# Altium schematic sheet adc.SchDoc: ADC
size A; Organization: UCLA HEP; DocumentNumber: 13; Revision: 2.0; SheetNumber: 13; SheetTotal: 14
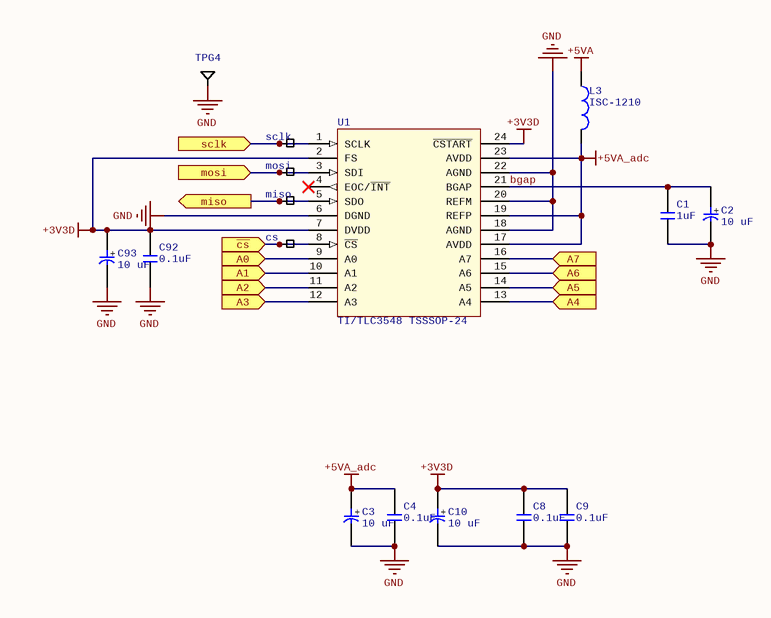
[diagram p0: adc.SchDoc]

## Parts
C1  1uF  [C0603]
C2  10 uF  [KEMET 1206]
C3  10 uF  [KEMET 1206]
C4  0.1uF  [C0603]
C8  0.1uF  [C0603]
C9  0.1uF  [C0603]
C10  10 uF  [KEMET 1206]
C92  0.1uF  [C0603]
C93  10 uF  [KEMET 1206]
cs  TP_SMALL  [TP_SMALL]  (value not drawn)
L3  ISC-1210  [ISC-1210]
miso  TP_SMALL  [TP_SMALL]  (value not drawn)
mosi  TP_SMALL  [TP_SMALL]  (value not drawn)
sclk  TP_SMALL  [TP_SMALL]  (value not drawn)
TPG4  TPG  [TPG]  (value not drawn)
U1  TI/TLC3548 TSSSOP-24  [TSSOP-24]

## Ports
A0 (in), A1 (in), A2 (in), A3 (in), A4 (in), A5 (in), A6 (in), A7 (in), miso (out), mosi (in), sclk (in), ~{cs} (in)

## Nets
+3V3D: C8.2 C9.2 C10.1(+) C92.2 C93.1(+) U1.2(FS) U1.7(DVDD) U1.24(~{CSTART})
+5VA: L3.2
+5VA_adc: C3.1(+) C4.2 L3.1 U1.17(AVDD) U1.19(REFP) U1.23(AVDD)
GND: C1.2 C2.2(-) C3.2(-) C4.1 C8.1 C9.1 C10.2(-) C92.1 C93.2(-) TPG4.1 U1.6(DGND) U1.18(AGND) U1.20(REFM) U1.22(AGND)
A0: U1.9(A0) ; port A0
A1: U1.10(A1) ; port A1
A2: U1.11(A2) ; port A2
A3: U1.12(A3) ; port A3
A4: U1.13(A4) ; port A4
A5: U1.14(A5) ; port A5
A6: U1.15(A6) ; port A6
A7: U1.16(A7) ; port A7
bgap: C1.1 C2.1(+) U1.21(BGAP)
~{cs}: cs.1 U1.8(~{CS}) ; port ~{cs}
miso: miso.1 U1.5(SDO) ; port miso
mosi: mosi.1 U1.3(SDI) ; port mosi
sclk: sclk.1 U1.1(SCLK) ; port sclk

Not connected (* = marked no-connect by the designer): U1 4(EOC/~{INT})*

## Notes on the sheet
- Size:
- A
- Revision:
- Date:
- Sheet
- of

## Library data of the parts
C1 = Murata/GRM188R61E105KA12D: CAP2, CER, 1.0uF, 10%, 25V, 0603; Manufacturer: Murata Electronics North America; Capacitance: 1µF; Temperature Coefficient: X5R; Supplier 1: Digi-Key; Supplier Part Number 1: 490-3897-1-ND; Manufacturer Part Number: GRM188R61E105KA12D; RoHS: RoHS Compliant; Category: Capacitors; Stock 1: 1899119; Pricing 1: 1=0.1, 10=0.036, 50=0.0196, 100=0.0165, 250=0.01352, 500=0.01156, 1000=0.009 (USD); Packaging: Cut Tape (CT); Tolerance: ±10%; Voltage - Rated: 25V; Mounting Type: Surface Mount, MLCC; Operating Temperature: -55°C ~ 85°C; Applications: General Purpose; Ratings: -; Package / Case: 0603 (1608 Metric); Size / Dimension: 0.063" L x 0.031" W (1.60mm x 0.80mm); Height - Seated (Max): -; Thickness (Max): 0.035" (0.90mm); Lead Spacing: -; Features: -; Lead Style: -; ComponentLink1URL: http://www.murata.com/~/media/webrenewal/support/library/catalog/products/capacitor/mlcc/c02e.pdf; ComponentLink1Description: http://www.murata.com/~/media/webrenewal/support/library/catalog/products/capacitor/mlcc/c02e.pdf
C2 C3 C10 C93 = Kemet/T491A106K010AT: CAP2, TANT,  10uF, 10%, 10V, 1206; Manufacturer: Kemet; Manufacturer Size Code: A; Capacitance: 10µF; ESR (Equivalent Series Resistance): 3.8 Ohm; Type: Molded; Lifetime @ Temp.: 2000 Hrs @ 85°C; Supplier 1: Newark; Manufacturer Part Number: T491A106K010AT; RoHS: RoHS Compliant; Category: Capacitors; Packaging: Cut Tape (CT); Tolerance: ±10%; Voltage - Rated: 10V; Mounting Type: Surface Mount; Operating Temperature: -55°C ~ 125°C; Package / Case: 1206 (3216 Metric); Size / Dimension: 0.126" L x 0.063" W (3.20mm x 1.60mm); Height - Seated (Max): 0.071" (1.80mm); Lead Spacing: -; Features: General Purpose; ComponentLink1URL: http://www.kemet.com/Lists/ProductCatalog/Attachments/254/KEM_T2005_T491.pdf; ComponentLink1Description: http://www.kemet.com/Lists/ProductCatalog/Attachments/254/KEM_T2005_T491.pdf; Supplier Part Number 1: 57K1635; Supplier 2: Digi-Key; Stock 2: 145394; Pricing 2: 1=0.38, 10=0.337, 50=0.2044, 100=0.1684, 250=0.13468, 500=0.12266, 1000=0.11063 (USD); Supplier Part Number 2: 399-3684-6-ND; Supplier 3: Digi-Key; Supplier Part Number 3: 399-3684-1-ND
C4 C8 C9 C92 = CAP/06035C104KAT2A: CAP2, CER, 0.1uF, 10%, 50V, 0603, X7R; Manufacturer: AVX Corporation; Capacitance: 0.10µF; Supplier 1: Digi-Key; Manufacturer Part Number: 06035C104KAT2A; RoHS: RoHS Compliant; Category: Capacitors; Stock 1: 4412408; Pricing 1: 1=0.1, 10=0.036, 25=0.0264, 50=0.0198, 100=0.0162, 250=0.01352, 500=0.01156, 1000=0.00908 (USD); Packaging: Cut Tape (CT); Tolerance: ±10%; Voltage - Rated: 50V; Temperature Coefficient: X7R; Mounting Type: Surface Mount, MLCC; Operating Temperature: -55°C ~ 125°C; Applications: General Purpose; Ratings: -; Package / Case: 0603 (1608 Metric); Size / Dimension: 0.063" L x 0.032" W (1.60mm x 0.81mm); Height - Seated (Max): -; Thickness (Max): 0.035" (0.90mm); Lead Spacing: -; Features: -; Lead Style: -; ComponentLink1URL: http://datasheets.avx.com/X7RDielectric.pdf; ComponentLink1Description: http://datasheets.avx.com/X7RDielectric.pdf; Supplier 2: Newark; Supplier Part Number 1: 478-5052-1-ND; Supplier Part Number 2: 54K2412
cs miso mosi sclk = TP_SMALL: Test Point, Generic, 50MIL
L3 = ISC-1210: IND, 86uF, 90mA; Supplier 1: Digi-Key; Supplier Part Number 1: 541-1604-1-ND
TPG4 = TPG: Test Point, GND, Through Hole
U1 = TI/TLC3548 TSSSOP-24: ADC, 14-Bit,; Manufacturer: Texas Instruments; Manufacturer Part Number: TLC3548CPW; Number of Bits: 14; Sampling Rate (Per Second): 200k; Number of Inputs: 8; Input Type: Pseudo-Differential, Single Ended; Data Interface: SPI, DSP; Configuration: MUX-S/H-ADC; Ratio - S/H:ADC: 1:1; Number of A/D Converters: 1; Architecture: SAR; Reference Type: Internal; Voltage - Supply, Analog: 5V; Voltage - Supply, Digital: 2.7 V ~ 5.5 V; Supplier 1: Digi-Key; RoHS: RoHS Compliant; Category: Integrated Circuits (ICs); Packaging: Tube; Features: -; Operating Temperature: 0°C ~ 70°C; Package / Case: 24-TSSOP (0.173", 4.40mm Width); Supplier Device Package: 24-TSSOP; ComponentLink1URL: http://www.ti.com/lit/ds/symlink/tlc3544.pdf; ComponentLink1Description: http://www.ti.com/lit/ds/symlink/tlc3544.pdf; Stock 1: 2; Pricing 1: 1=15.35, 10=13.95, 50=12.9038, 100=11.8575, 250=10.81124, 500=10.11376, 750=9.62551, 1000=8.71875 (USD); Supplier Part Number 1: 296-34357-5-ND